# EAGLE design Model01_ANAL (EAGLE 7.6.0)
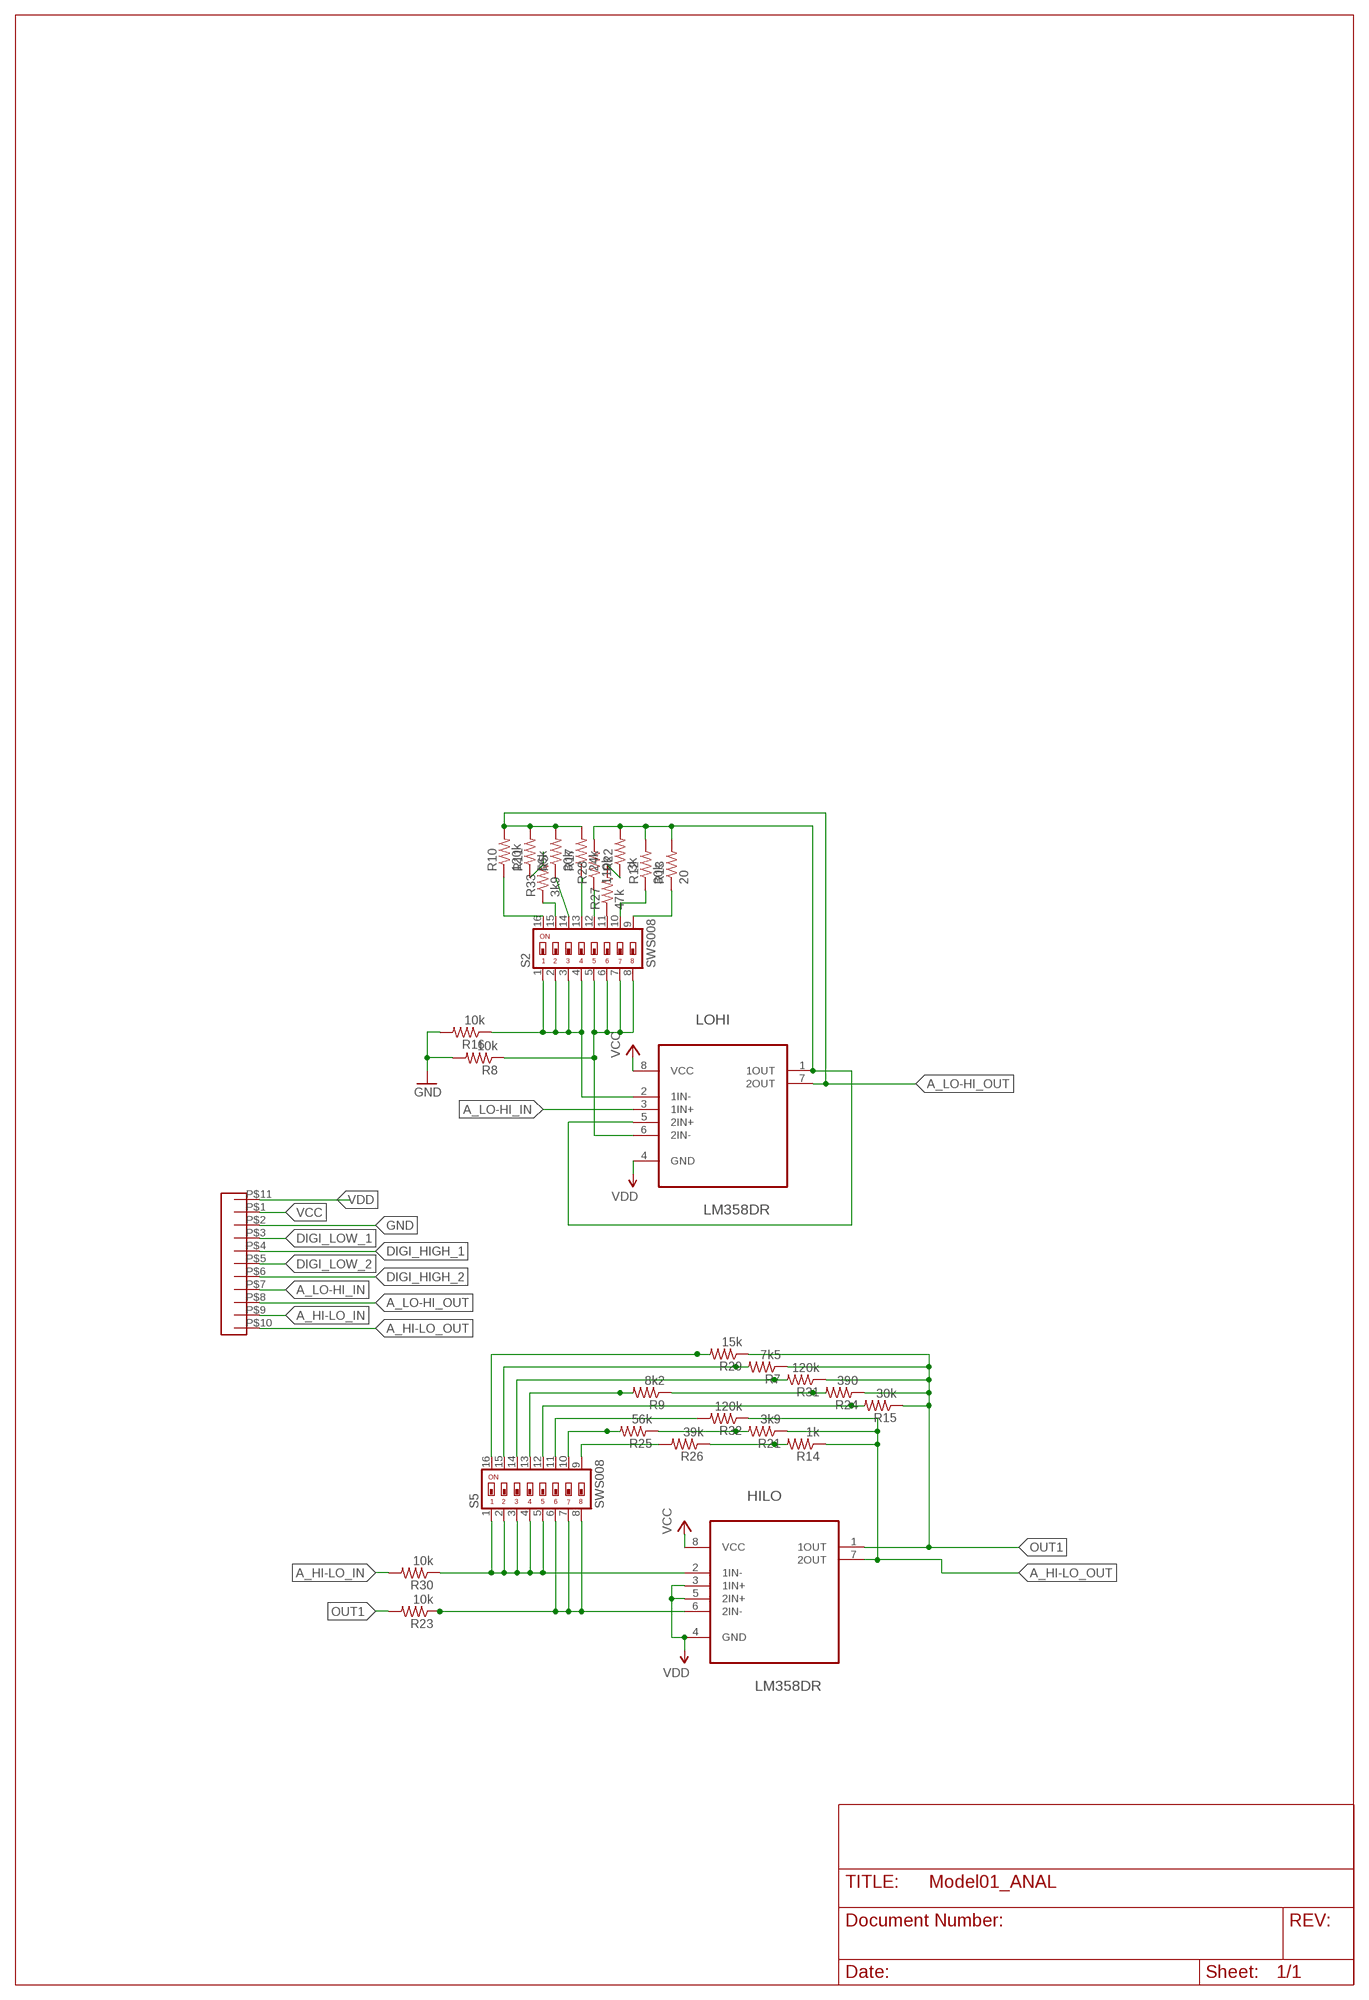
[diagram p0: schematic, sheet 1]

## Parts
HILO  LM358DR  [SOIC127P600X175-8N]
LOHI  LM358DR  [SOIC127P600X175-8N]
R5  30k  R-US_R0805  [R0805]
R7  7k5  R-US_R0805  [R0805]
R8  10k  R-US_R0805  [R0805]
R9  8k2  R-US_R0805  [R0805]
R10  120k  R-US_R0805  [R0805]
R11  56k  R-US_R0805  [R0805]
R12  30k  R-US_R0805  [R0805]
R13  20  R-US_R0805  [R0805]
R14  1k  R-US_R0805  [R0805]
R15  30k  R-US_R0805  [R0805]
R16  10k  R-US_R0805  [R0805]
R17  24k  R-US_R0805  [R0805]
R21  3k9  R-US_R0805  [R0805]
R22  3k  R-US_R0805  [R0805]
R23  10k  R-US_R0805  [R0805]
R24  390  R-US_R0805  [R0805]
R25  56k  R-US_R0805  [R0805]
R26  39k  R-US_R0805  [R0805]
R27  47k  R-US_R0805  [R0805]
R28  110k  R-US_R0805  [R0805]
R29  15k  R-US_R0805  [R0805]
R30  10k  R-US_R0805  [R0805]
R31  120k  R-US_R0805  [R0805]
R32  120k  R-US_R0805  [R0805]
R33  3k9  R-US_R0805  [R0805]
S2  SWS008  [SMS-008]
S5  SWS008  [SMS-008]
U$1  5.08PITCHTERMINAL  [10KPL508]

## Nets
A_HI-LO_IN: R30.2 U$1.P$9
A_HI-LO_OUT: HILO.7(2OUT) R14.1 R21.1 R32.1 U$1.P$10
A_LO-HI_IN: LOHI.3(1IN+) U$1.P$7
A_LO-HI_OUT: LOHI.7(2OUT) R5.2 R10.2 R11.2 R17.2 U$1.P$8
DIGI_HIGH_1: U$1.P$4
DIGI_HIGH_2: U$1.P$6
DIGI_LOW_1: U$1.P$3
DIGI_LOW_2: U$1.P$5
GND: R8.2 R16.2 U$1.P$2
N$10: HILO.2(1IN-) R30.1 S5.1 S5.2 S5.3 S5.4 S5.5
N$13: R10.1 S2.16
N$14: R33.1 S2.15
N$16: R5.1 S2.14
N$17: R17.1 S2.13
N$18: R28.1 S2.12
N$19: R27.1 S2.11
N$20: R12.1 S2.10
N$21: R13.1 S2.9
N$22: R29.2 S5.16
N$23: LOHI.1(1OUT) LOHI.5(2IN+) R12.2 R13.2 R22.2 R28.2
N$24: R7.2 S5.15
N$26: R31.2 S5.14
N$27: R9.2 S5.13
N$28: R15.2 S5.12
N$29: R32.2 S5.11
N$30: HILO.6(2IN-) R23.1 S5.6 S5.7 S5.8
N$31: R25.2 S5.10
N$32: R26.2 S5.9
N$34: R14.2 R26.1
N$36: R21.2 R25.1
N$37: R9.1 R24.2
N$38: R22.1 R27.2
N$41: R11.1 R33.2
N$46: LOHI.2(1IN-) R16.1 S2.1 S2.2 S2.3 S2.4
N$50: LOHI.6(2IN-) R8.1 S2.5 S2.6 S2.7 S2.8
OUT1: HILO.1(1OUT) R7.1 R15.1 R23.2 R24.1 R29.1 R31.1
VCC: HILO.8(VCC) LOHI.8(VCC) U$1.P$1
VDD: HILO.3(1IN+) HILO.4(GND) HILO.5(2IN+) LOHI.4(GND) U$1.P$11

## Library data of the parts
HILO LOHI = Texas Instruments_By_element14_Batch_1:LM358DR: OPERATIONAL AMPLIFIERS; MPN: LM358DR; OC_FARNELL: 1831865; OC_NEWARK: 34K7599; PACKAGE: SOIC-8; SUPPLIER: Texas Instruments
R5 R7-R17 R21-R33 = rcl:R-US_: RESISTOR, American symbol
S2 S5 = smd-special:SWS008: SMD Dip Switch 8 pol.
U$1 = ruuviliitin:5.08PITCHTERMINAL

## Net classes
0 default: clearance 0.205 mm

## Board
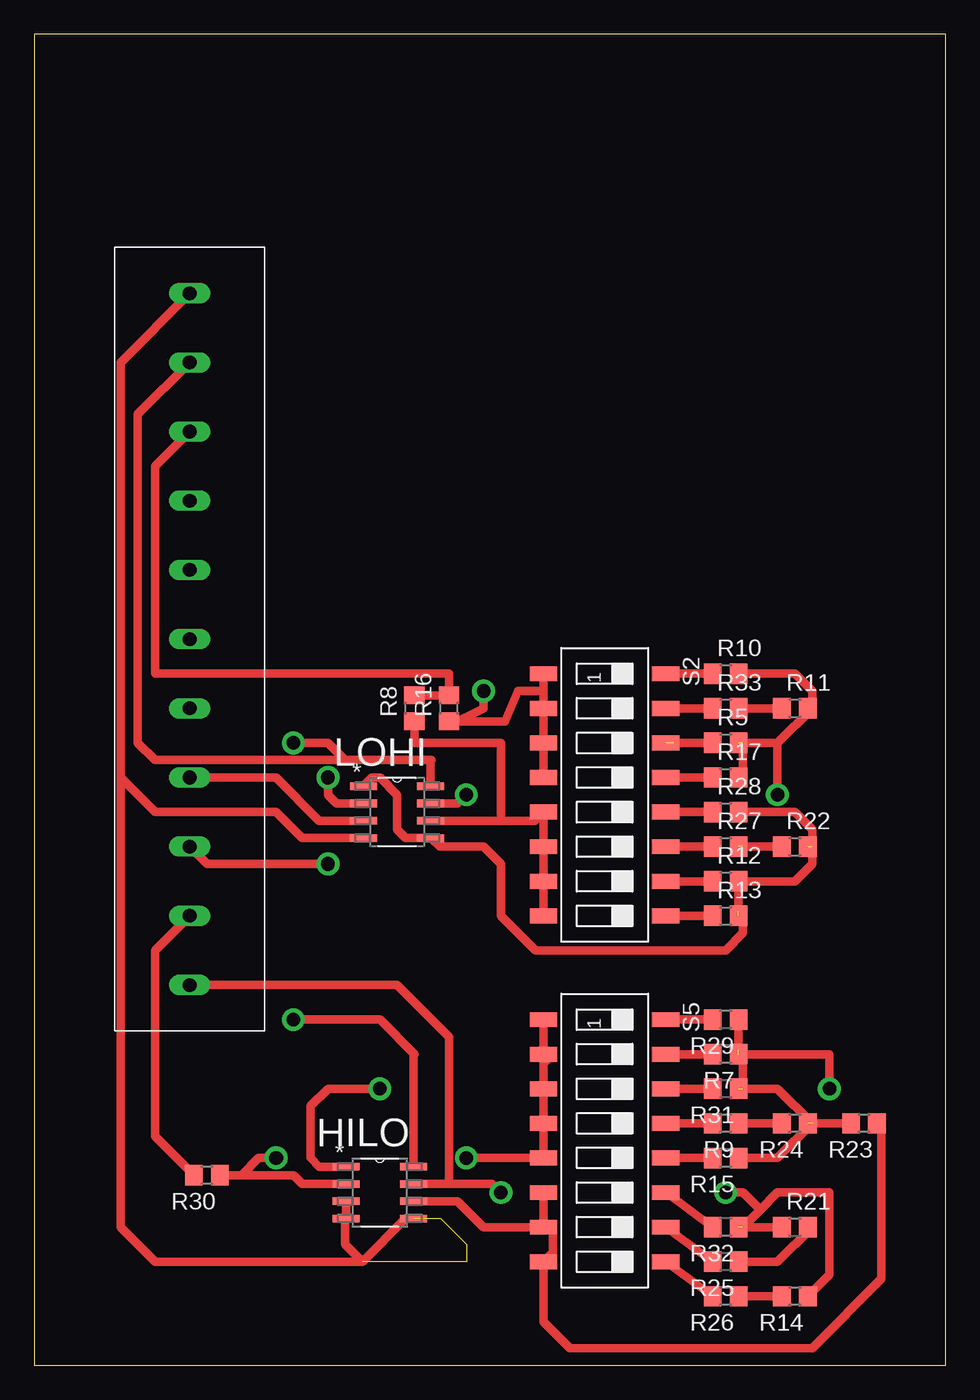
[diagram p1: board, top side]
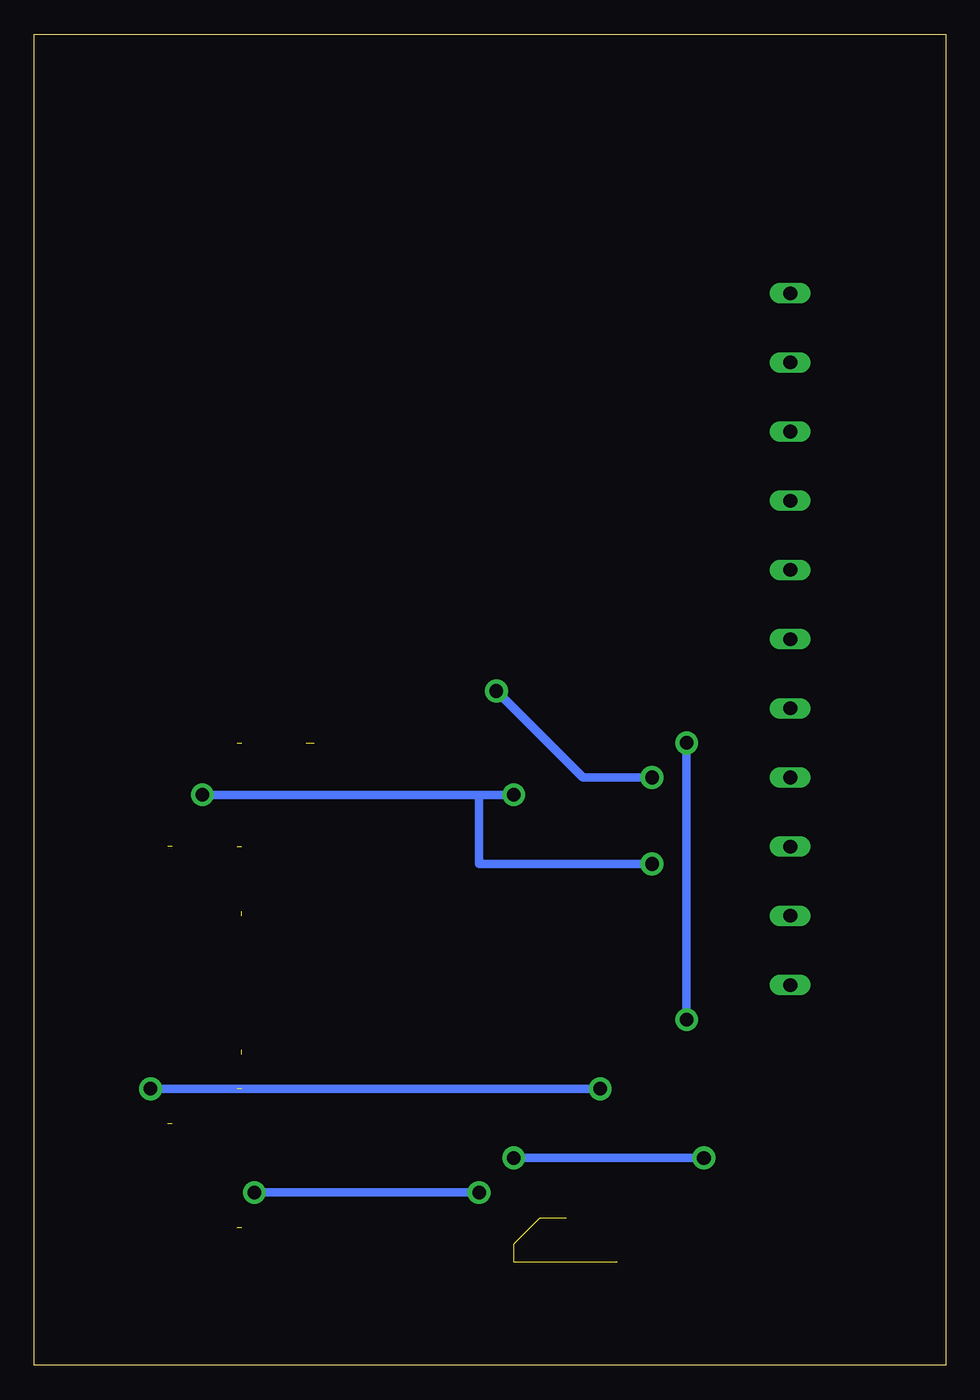
[diagram p2: board, bottom side, seen from below]

Size 66.98 x 97.78 mm. Coordinates in mm from the lower left corner, seen from the top.
Outline: 0,0 66.98,0 66.98,97.78 0,97.78 0,0
Copper layers (1*16): Top 0.035mm / dielectric 1.5mm / Bottom 0.035mm
Design rules "default": minimum track width 10mil, minimum drill 24mil, track to track 8mil, track to pad 8mil, pad to pad 8mil, via to via 8mil, smd to smd 8mil, copper to edge 40mil, drill to drill 8mil, minimum pad ring 10mil, minimum via ring 8mil, stop-mask expansion 4mil, vias tented up to drill 0mil, thermal gap 10mil

### Footprints (pad centres in the part's own frame; a part is rotated, then mirrored left to right if it is on the bottom)
SOIC127P600X175-8N = smd 1.981 x 0.559: 1 -2.464,1.905; 2 -2.464,0.635; 3 -2.464,-0.635; 4 -2.464,-1.905; 5 2.464,-1.905; 6 2.464,-0.635; 7 2.464,0.635; 8 2.464,1.905
R0805 = smd 1.3 x 1.5: 1 -0.95,0; 2 0.95,0
SMS-008 = smd 1.092 x 2.007: 1 -8.89,-4.496; 2 -6.35,-4.496; 3 -3.81,-4.496; 4 -1.27,-4.496; 5 1.27,-4.496; 6 3.81,-4.496; 7 6.35,-4.496; 8 8.89,-4.496; 9 8.89,4.496; 10 6.35,4.496; 11 3.81,4.496; 12 1.27,4.496; 13 -1.27,4.496; 14 -3.81,4.496; 15 -6.35,4.496; 16 -8.89,4.496
10KPL508 = drill 1 long: P$1 -20.32,0; P$2 -15.24,0; P$3 -10.16,0; P$4 -5.08,0; P$5 0,0; P$6 5.08,0; P$7 10.16,0; P$8 15.24,0; P$9 20.32,0; P$10 25.4,0; P$11 -25.4,0

### Placement (x,y rotation side)
HILO  25.4,12.7 0 top
LOHI  26.67,40.64 0 top
R5  50.8,45.72 0 top
R7  50.8,22.86 180 top
R8  27.94,48.26 90 top
R9  50.8,17.78 180 top
R10  50.8,50.8 0 top
R11  55.88,48.26 0 top
R12  50.8,35.56 0 top
R13  50.8,33.02 0 top
R14  55.88,5.08 180 top
R15  50.8,15.24 180 top
R16  30.48,48.26 90 top
R17  50.8,43.18 0 top
R21  55.88,10.16 0 top
R22  55.88,38.1 0 top
R23  60.96,17.78 180 top
R24  55.88,17.78 180 top
R25  50.8,7.62 180 top
R26  50.8,5.08 180 top
R27  50.8,38.1 0 top
R28  50.8,40.64 0 top
R29  50.8,25.4 180 top
R30  12.7,13.97 180 top
R31  50.8,20.32 180 top
R32  50.8,10.16 180 top
R33  50.8,48.26 0 top
S2  41.91,41.91 270 top
S5  41.91,16.51 270 top
U$1  11.43,53.34 270 top

### Tracks (layer width: path | path; a pad name or v marks a point on that pad's centre or on a via)
A_HI-LO_IN
  Top 0.61: U$1.P$9 8.89,30.48 8.89,16.83 R30.2
A_HI-LO_OUT  (via drill 1 pad 1.68)  (1 unrouted)
  Top 0.61: R14.1 58.42,6.67 58.42,12.7 54.61,12.7 53.34,11.43 | 53.34,11.43 52.07,10.16 R21.1 | HILO.7 30.48,13.34 | 30.48,13.34 33.66,13.34 v34.29,12.7 | v50.8,12.7 52.07,12.7 53.34,11.43 | U$1.P$10 26.67,27.94 30.48,24.13 30.48,13.34
  Bottom 0.61: v34.29,12.7 v50.8,12.7
A_LO-HI_IN
  Top 0.61: LOHI.3 20.95,40.01 17.78,43.18 U$1.P$7
A_LO-HI_OUT  (via drill 1 pad 1.68)  (1 unrouted)
  Top 0.61: LOHI.7 31.11,41.27 v31.75,41.91 | v54.61,41.91 54.61,45.72 | 54.61,45.72 52.07,45.72 52.07,43.18 R17.2 | 54.61,45.72 57.15,48.26 R11.2 57.15,48.58 57.15,49.53 55.88,50.8 R10.2 | U$1.P$8 12.7,36.83 v21.59,36.83
  Bottom 0.61: v31.75,41.91 34.29,41.91 | 34.29,41.91 v54.61,41.91 | v21.59,36.83 34.29,36.83 34.29,41.91
GND
  Top 0.61: R8.2 R16.2 30.48,50.8 8.89,50.8 8.89,66.04 U$1.P$2
N$10  (via drill 1 pad 1.68)
  Top 0.61: S5.1 S5.2 | 38.1,22.86 37.41,22.17 S5.3 S5.2 | S5.2 S5.4 S5.5 v31.75,15.24 | HILO.2 19.68,13.34 19.05,13.97 15.24,13.97 | 15.24,13.97 R30.1 | v17.78,15.24 16.51,15.24 15.24,13.97
  Bottom 0.61: v31.75,15.24 v17.78,15.24
N$13
  Top 0.61: S2.16 R10.1
N$14
  Top 0.61: S2.15 R33.1
N$16  (1 unrouted)
  Top 0.61: R5.1 46.99,45.72
N$17
  Top 0.61: S2.13 R17.1
N$18
  Top 0.61: S2.12 R28.1
N$19
  Top 0.61: S2.11 R27.1
N$20
  Top 0.61: S2.10 R12.1
N$21
  Top 0.61: S2.9 R13.1
N$22
  Top 0.61: S5.16 R29.2
N$23  (2 unrouted)
  Top 0.61: R22.2 57.15,37.78 57.15,36.83 55.88,35.56 R12.2 51.75,33.34 52.07,33.02 52.07,31.75 50.8,30.48 36.83,30.48 34.29,33.02 34.29,36.83 33.02,38.1 29.77,38.1 LOHI.5 27.3,38.73 26.67,39.37 26.67,41.91 25.4,43.18 24.84,43.18 LOHI.1 | R28.2 55.88,40.64 57.15,39.37 57.15,38.1
N$24
  Top 0.61: S5.15 R7.2
N$26
  Top 0.61: S5.14 R31.2
N$27
  Top 0.61: S5.13 R9.2
N$28
  Top 0.61: S5.12 R15.2
N$29
  Top 0.61: S5.11 R32.2
N$30
  Top 0.61: R23.1 62.23,17.46 62.23,6.35 57.15,1.27 39.37,1.27 37.41,3.23 S5.8 38.1,8.31 38.1,10.16 S5.7 | HILO.6 31.11,12.06 33.02,10.16 S5.7 | S5.7 S5.6
N$31
  Top 0.61: S5.10 R25.2
N$32
  Top 0.61: S5.9 R26.2
N$34
  Top 0.61: R26.1 R14.2
N$36
  Top 0.61: R25.1 54.61,7.62 57.15,10.16 R21.2
N$37
  Top 0.61: R24.2 R9.1
N$38  (1 unrouted)
  Top 0.61: R22.1 52.07,38.1
N$41
  Top 0.61: R11.1 R33.2
N$46  (via drill 1 pad 1.68)
  Top 0.61: S2.1 37.41,49.53 | 37.41,49.53 S2.2 S2.3 S2.4 | 37.41,49.53 35.56,49.53 34.61,47.31 R16.1 30.48,46.99 33.02,48.26 v33.02,49.53 | v21.59,43.18 21.59,41.91 22.23,41.27 LOHI.2
  Bottom 0.61: v33.02,49.53 26.67,43.18 v21.59,43.18
N$50
  Top 0.61: S2.8 S2.7 S2.6 S2.5 36.78,40.01 34.29,40.01 | LOHI.6 34.29,40.01 | R8.1 27.94,45.72 34.29,45.72 34.29,40.01
OUT1  (via drill 1 pad 1.68)  (3 unrouted)
  Top 0.61: R15.1 54.61,15.24 57.15,17.78 54.61,20.32 52.07,20.32 52.07,22.86 51.75,23.18 R29.1 | R23.2 R24.1 | HILO.1 20.95,14.61 20.32,15.24 20.32,19.05 21.59,20.32 v25.4,20.32 | v58.42,20.32 58.42,22.86 R7.1
  Bottom 0.61: v25.4,20.32 v58.42,20.32
VCC  (via drill 1 pad 1.68)
  Top 0.61: LOHI.8 29.13,44.37 29.21,44.45 22.86,44.45 | 22.86,44.45 8.89,44.45 7.62,45.72 7.62,69.85 U$1.P$1 | HILO.8 27.86,22.78 27.94,22.86 25.4,25.4 v19.05,25.4 | v19.05,45.72 21.59,45.72 22.86,44.45
  Bottom 0.61: v19.05,25.4 v19.05,45.72
VDD  (4 unrouted)
  Top 0.61: LOHI.4 19.68,38.73 17.78,40.64 8.89,40.64 6.35,43.18 | 6.35,43.18 6.35,73.66 U$1.P$11 | 24.13,7.62 22.86,8.89 22.86,10.72 HILO.4 HILO.3 | HILO.5 27.3,10.79 24.13,7.62 | 24.13,7.62 8.89,7.62 6.35,10.16 6.35,43.18